# EasyEDA schematic SCH_Controladora-Exaustao-Chamine.json
TITLE: Esquema Eletrônico; REV: 1.0; Date: 2024-02-29; Sheet: 1/1; Drawn By: marlon.yow; Company: MAVALERIO
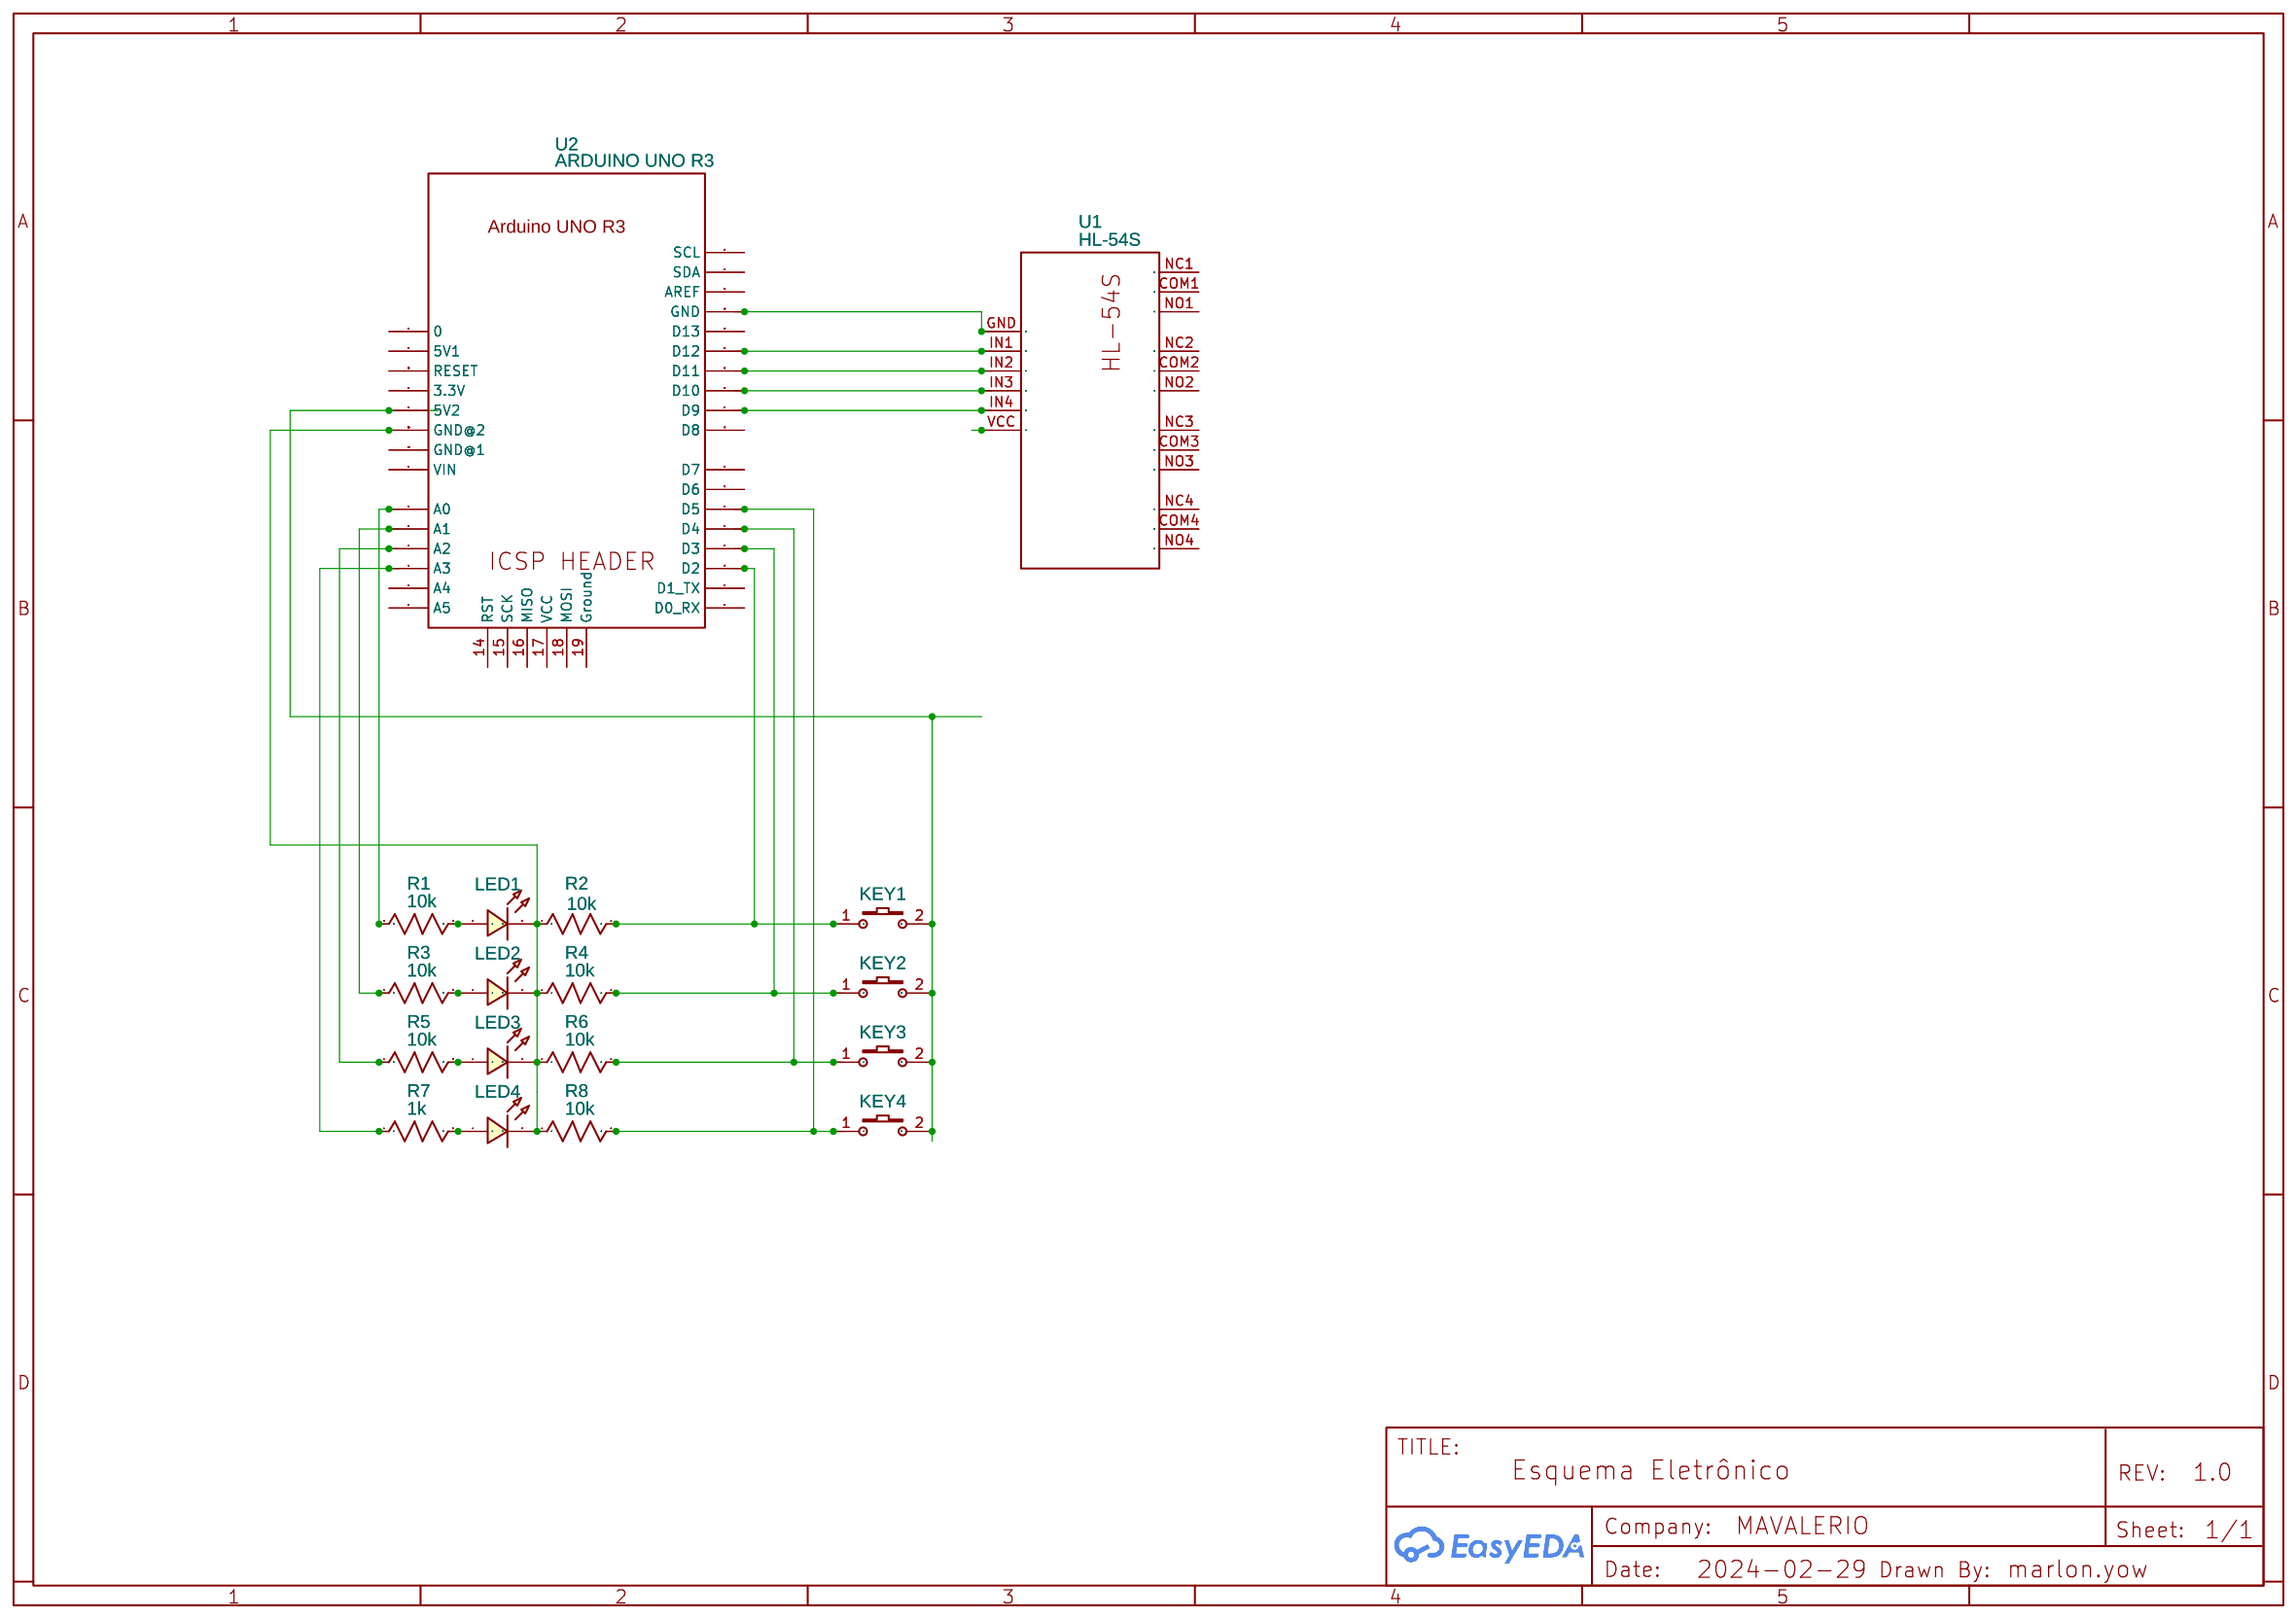
[diagram p0: schematic sheet]

## Parts
KEY1  K2-3.6×6.1_SMD  [KEY-SMD_2P-L6.2-W3.6-LS8.0]
KEY2  K2-3.6×6.1_SMD  [KEY-SMD_2P-L6.2-W3.6-LS8.0]
KEY3  K2-3.6×6.1_SMD  [KEY-SMD_2P-L6.2-W3.6-LS8.0]
KEY4  K2-3.6×6.1_SMD  [KEY-SMD_2P-L6.2-W3.6-LS8.0]
LED1  LED-YELLOW  [LED0603_RED]
LED2  LED-0603_R  [LED0603_RED]
LED3  LED-0603_R  [LED0603_RED]
LED4  LED-0603_R  [LED0603_RED]
R1  10k  [R0603]
R2  10k  [R0603]
R3  10k  [R0603]
R4  10k  [R0603]
R5  10k  [R0603]
R6  10k  [R0603]
R7  1k  [R0603]
R8  10k  [R0603]
U1  HL-54S
U2  ARDUINO UNO R3  [UNO SMD UNO R3]

## Library data of the parts
KEY1-KEY4 = K2-3.6×6.1_SMD: Supplier Part: C118141; Supplier: LCSC; Manufacturer Part: K2-1107ST-A4SW-06; Contributor: LCEDA_Lib; 制造商: 韩国韩荣
LED1-LED4 = LED-0603_R: Manufacturer: EVERLIGHT(台湾亿光); Manufacturer Part: 19-217/R6C-AL1M2VY/3T; Supplier Part: C72044; Supplier: LCSC; Contributor: LCEDA_01
R1-R8 = R_0603_US: Contributor: LCEDA_Lib
U1 = HL-54S: Contributor: Михаил Шутов
U2 = ARDUINO UNO R3 BEST: Contributor: Kpa Krim

## Nets
Net-(KEY1-1): KEY1.1 R2.2 U2.D2
Net-(KEY1-2): KEY1.2 KEY2.2 KEY3.2 KEY4.2 U2.5V2
Net-(KEY2-1): KEY2.1 R4.2 U2.D3
Net-(KEY3-1): KEY3.1 R6.2 U2.D4
Net-(KEY4-1): KEY4.1 R8.2 U2.D5
Net-(LED1-1): LED1.1 R1.2
Net-(LED1-2): LED1.2 LED2.2 LED3.2 LED4.2 R2.1 R4.1 R6.1 R8.1 U2.GND@2
Net-(LED2-1): LED2.1 R3.2
Net-(LED3-1): LED3.1 R5.2
Net-(LED4-1): LED4.1 R7.2
Net-(R1-1): R1.1 U2.A0
Net-(R3-1): R3.1 U2.A1
Net-(R5-1): R5.1 U2.A2
Net-(R7-1): R7.1 U2.A3
Net-(U1-GND): U1.GND(1) U2.GND
Net-(U1-IN1): U1.IN1(1) U2.D12
Net-(U1-IN2): U1.IN2(1) U2.D11
Net-(U1-IN3): U1.IN3(1) U2.D10
Net-(U1-IN4): U1.IN4(1) U2.D9

Not connected (* = marked no-connect by the designer): U1 COM1(1) COM2(1) COM3(1) COM4(1) NC1(1) NC2(1) NC3(1) NC4(1) NO1(1) NO2(1) NO3(1) NO4(1) VCC(1); U2 0 3.3V 5V1 14(RST) 15(SCK) 16(MISO) 17(VCC) 18(MOSI) 19(Ground) A4 A5 AREF D0(D0_RX) D1(D1_TX) D6 D7 D8 D13 GND@1 RESET SCL SDA VIN
